# EAGLE design NFC_BusinessCard (EAGLE 9.6.2)
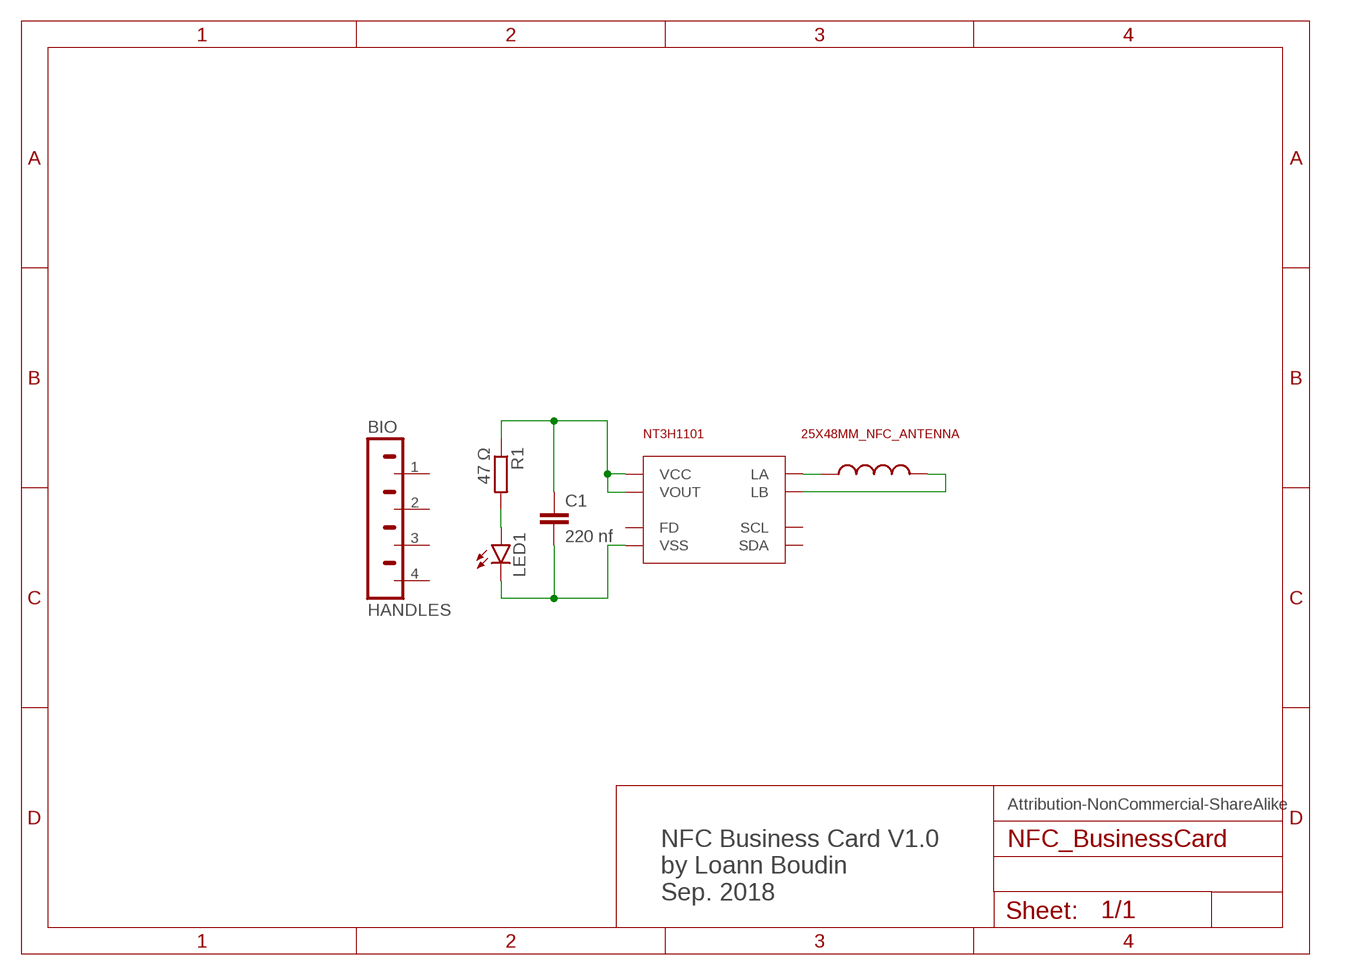
[diagram p0: schematic, sheet 1]

## Parts
ANT  25X48MM_NFC_ANTENNA  [25X48MM_NFC]
BIO  HANDLES  [MA08-1]
C1  220 nf  C-EUC0603  [C0603]
LED1  LEDSML0805  [SML0805]
NT3H1101  NT3H  [XQFN8]
R1  47 Ω  R-EU_R0603  [R0603]

## Nets
N$1: ANT.P$2 NT3H1101.LA
N$2: ANT.P$1 NT3H1101.LB
N$3: C1.1 NT3H1101.VCC NT3H1101.VOUT R1.1
N$4: LED1.A R1.2
N$6: C1.2 LED1.C NT3H1101.VSS
Unconnected: BIO.1 BIO.2 BIO.3 BIO.4 NT3H1101.FD NT3H1101.SCL NT3H1101.SDA

## Notes on the sheet
- Attribution-NonCommercial-ShareAlike
- NFC Business Card V1.0
  by Loann Boudin
  Sep. 2018

## Library data of the parts
ANT = PCB_BusinessCard:25X48MM_NFC_ANTENNA: 25x48 mm NFC loop antenna, L = 2,75 µH
BIO = handles:HANDLES
C1 = resistor:C-EU: CAPACITOR, European symbol
LED1 = led:LED: LED OSRAM: - CHIPLED LG R971, LG N971, LY N971, LG Q971, LY Q971, LO R971, LY R971 LH N974, LH R974 LS Q976, LO Q976, LY Q976 LO Q996 - Hyper CHIPLED LW Q18S LB Q993, LB Q99A, LB R99A - SideLED LS A670, LO A670, LY A670, LG A670, LP A670 LB A673, LV A673, LT A673, LW A673 LH A674 LY A675 LS A676, LA A676, LO A676, LY A676, LW A676 LS A679, LY A679, LG A679 - Hyper Micro SIDELED® LS Y876, LA Y876, LO Y876, LY Y876 LT Y87S - SmartLED LW L88C, LW L88S LB L89C, LB L89S, LG L890 LS L89K, LO L89K, LY L89K LS L896, LA L896, LO L896, LY L896 - TOPLED LS T670, LO T670, LY T670, LG T670, LP T670 LSG T670, LSP T670, LSY T670, LOP T670, LYG T670 LG T671, LOG T671, LSG T671 LB T673, LV T673, LT T673, LW T673 LH T674 LS T676, LA T676, LO T676, LY T676, LB T676, LH T676, LSB T676, LW T676 LB T67C, LV T67C, LT T67C, LS T67K, LO T67K, LY T67K, LW E67C LS E67B, LA E67B, LO E67B, LY E67B, LB E67C, LV E67C, LT E67C LW T67C LS T679, LY T679, LG T679 LS T770, LO T770, LY T770, LG T770, LP T770 LB T773, LV T773, LT T773, LW T773 LH T774 LS E675, LA E675, LY E675, LS T675 LS T776, LA T776, LO T776, LY T776, LB T776 LHGB T686 LT T68C, LB T68C - Hyper Mini TOPLED® LB M676 - Mini TOPLED Santana® LG M470 LS M47K, LO M47K, LY M47K Source: http://www.osram.convergy.de LUXEON: - LUMILED® LXK2-PW12-R00, LXK2-PW12-S00, LXK2-PW14-U00, LXK2-PW14-V00 LXK2-PM12-R00, LXK2-PM12-S00, LXK2-PM14-U00 LXK2-PE12-Q00, LXK2-PE12-R00, LXK2-PE12-S00, LXK2-PE14-T00, LXK2-PE14-U00 LXK2-PB12-K00, LXK2-PB12-L00, LXK2-PB12-M00, LXK2-PB14-N00, LXK2-PB14-P00, LXK2-PB14-Q00 LXK2-PR12-L00, LXK2-PR12-M00, LXK2-PR14-Q00, LXK2-PR14-R00 LXK2-PD12-Q00, LXK2-PD12-R00, LXK2-PD12-S00 LXK2-PH12-R00, LXK2-PH12-S00 LXK2-PL12-P00, LXK2-PL12-Q00, LXK2-PL12-R00 Source: www.luxeon.com KINGBRIGHT: KA-3528ASYC Source: www.kingbright.com
NT3H1101 = PCB_BusinessCard:NT3H
R1 = resistor:R-EU_: RESISTOR, European symbol

## Board
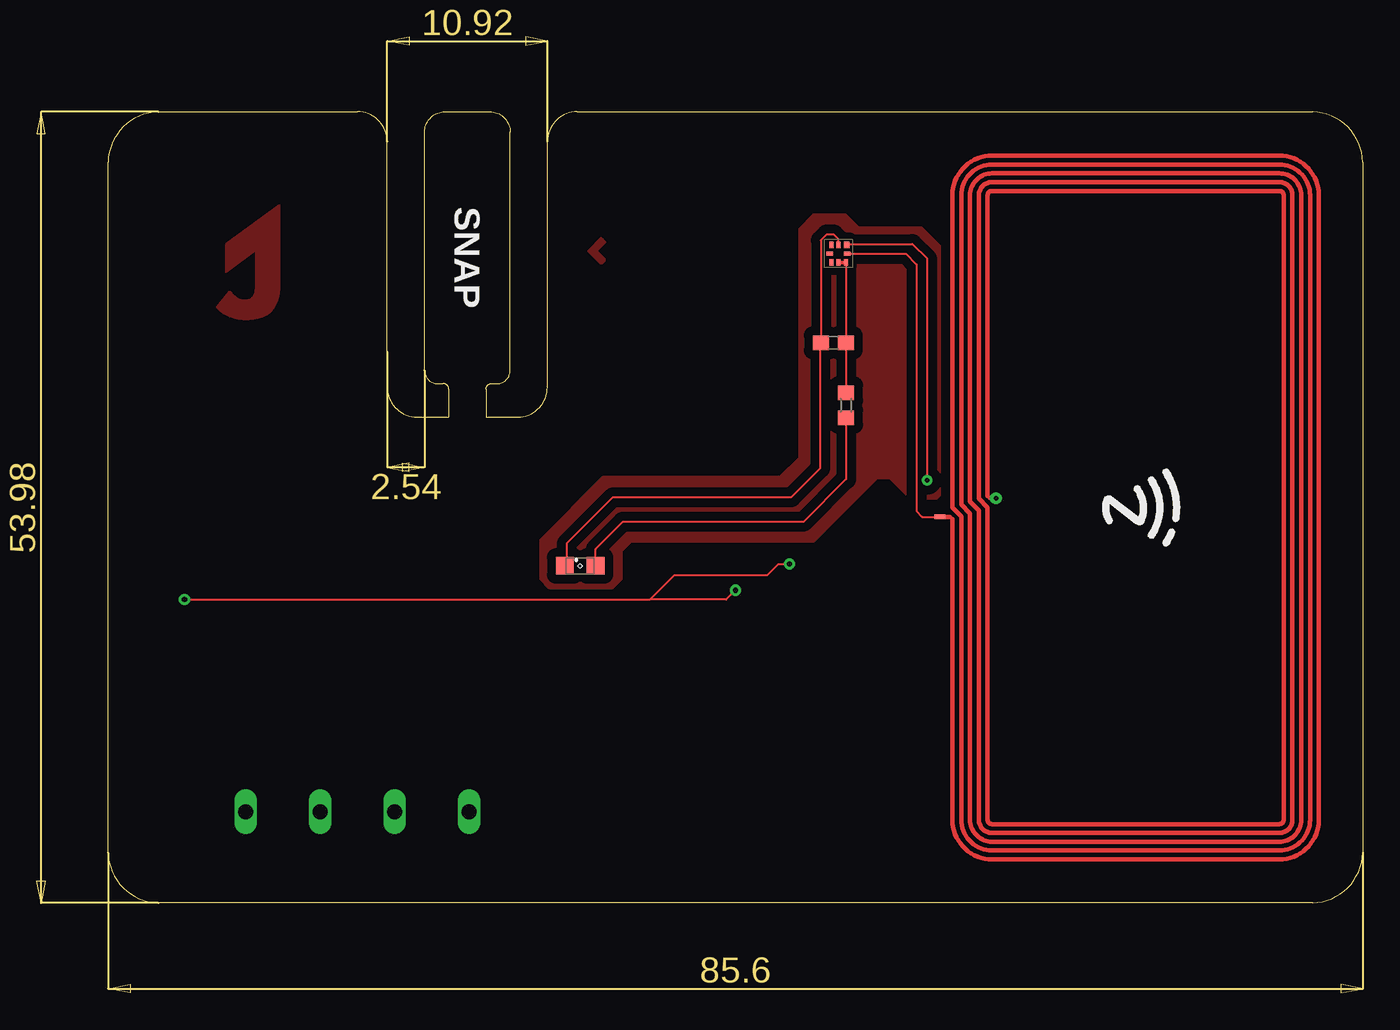
[diagram p1: board, top side]
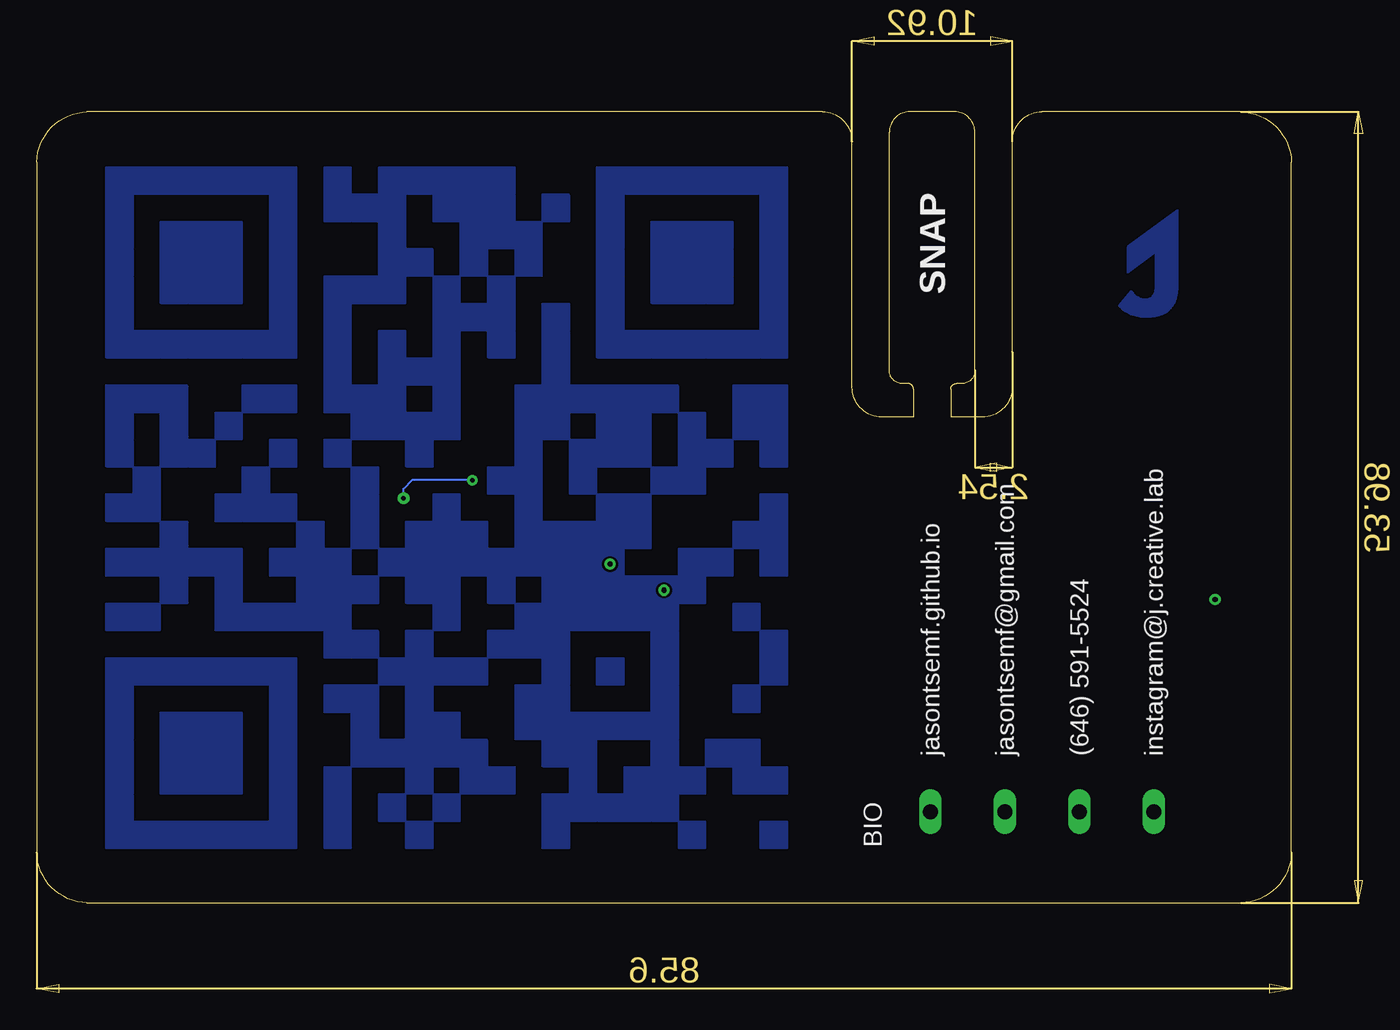
[diagram p2: board, bottom side, seen from below]

Size 85.6 x 53.98 mm. Coordinates in mm from the lower left corner, seen from the top.
Outline: 21.59,52.58 21.59,36.32 arc90 22.48,35.43 22.86,35.43 arc-90 23.24,35.05 23.24,33.15 21.08,33.15 arc-90 19.05,35.18 19.05,51.94 arc90 17.02,53.98 3.43,53.98 arc87 0,50.55 0,3.43 arc87 3.43,0 82.17,0 arc87 85.6,3.43 85.6,50.55 arc87 82.17,53.98 32,53.98 arc90 29.97,51.94 29.97,35.18 arc-90 27.94,33.15 25.78,33.15 25.78,35.05 arc-90 26.16,35.43 26.54,35.43 arc90 27.43,36.32 27.43,52.58 arc90 26.04,53.98 22.99,53.98
Outline: 21.59,52.58 arc-90 22.99,53.98
Outline: 21.59,52.58 arc-90 22.99,53.98
Copper layers (1*16): Top 0.035mm / dielectric 0.73mm / Bottom 0.035mm
Design rules "default *": minimum track width 6mil, minimum drill 0.3mm, track to track 6mil, track to pad 6mil, pad to pad 6mil, via to via 6mil, smd to smd 6mil, copper to edge 40mil, drill to drill 6mil, minimum pad ring 10mil, minimum via ring 8mil, stop-mask expansion 4mil, vias tented up to drill 0mil, thermal gap 10mil

### Footprints (pad centres in the part's own frame; a part is rotated, then mirrored left to right if it is on the bottom)
25X48MM_NFC = smd 0.3 x 0.75: P$1 -0.635,13.335 | drill 0.3: P$2 0.635,9.525
MA08-1 = drill 1.016 long: 1 -8.89,0; 2 -3.81,0; 3 1.27,0; 4 6.35,0
C0603 = smd 1.1 x 1: 1 -0.85,0; 2 0.85,0
SML0805 = smd 1.2 x 1.2: A 1.05,0; C -1.05,0
XQFN8 = smd 0.27 x 0.45: FD 0,-0.6; LB 0,0.6 | smd 0.45 x 0.37: LA -0.6,0.55 | smd 0.45 x 0.27: SCL -0.6,-0.5; SDA 0.6,-0.5; VCC 0.6,0; VOUT 0.6,0.5; VSS -0.6,0
R0603 = smd 1 x 1.1: 1 -0.85,0; 2 0.85,0

### Placement (x,y rotation side)
ANT  70.1,26.98 90 top
BIO  15.75,6.22 0 bottom
C1  49.48,38.21 180 top
LED1  32.21,23 0 top
NT3H1101  49.84,44.29 270 top
R1  50.34,33.95 270 top

### Tracks (layer width: path | path; a pad name or v marks a point on that pad's centre or on a via)
GND
  pour Top (rank 3): 7.4,40.66 7.44,40.61 7.5,40.55 7.55,40.5 7.6,40.44 7.66,40.39 7.72,40.35 7.78,40.3 7.84,40.25 7.9,40.21 7.96,40.17 8.03,40.14 8.1,40.1 8.16,40.07 8.23,40.04 8.3,40.01 8.44,39.95 8.59,39.91 8.73,39.87 8.88,39.84 9.03,39.82 9.18,39.81 9.33,39.8 9.48,39.8 9.63,39.8 9.78,39.81 9.93,39.83 10.08,39.86 10.23,39.89 10.37,39.93 10.44,39.95 10.52,39.98 10.58,40.01 10.65,40.04 10.72,40.07 10.79,40.11 10.85,40.15 10.91,40.19 10.97,40.24 11.03,40.28 11.09,40.33 11.14,40.39 11.19,40.44 11.24,40.5 11.29,40.56 11.33,40.62 11.37,40.69 11.41,40.75 11.44,40.82 11.48,40.89 11.51,40.95 11.53,41.02 11.56,41.1 11.58,41.17 11.6,41.24 11.64,41.39 11.66,41.54 11.68,41.69 11.69,41.84 11.7,41.91 11.7,42.06 11.7,47.56 11.7,47.64 8.05,44.96 8.03,44.9 8.03,43.02 10.03,44.49 10.06,44.46 10.06,41.97 10.05,41.9 10.05,41.82 10.04,41.75 10.02,41.67 10.01,41.6 9.98,41.53 9.95,41.46 9.91,41.4 9.86,41.34 9.81,41.29 9.75,41.24 9.68,41.2 9.62,41.17 9.54,41.15 9.47,41.14 9.39,41.13 9.32,41.13 9.24,41.13 9.17,41.14 9.1,41.15 9.02,41.17 8.95,41.2 8.88,41.23 8.82,41.26 8.75,41.3 8.69,41.34 8.63,41.39 8.57,41.44 8.52,41.49 8.47,41.54 8.42,41.6 8.32,41.72 8.27,41.7
  pour Bottom (rank 3): 80.87,50.2 79.03,50.2 79.01,50.15 79.01,48.38 79.05,48.34 80.82,48.34 80.87,48.36
  pour Bottom (rank 3): 79.01,50.2 77.17,50.2 77.15,50.15 77.15,48.38 77.19,48.34 78.96,48.34 79.01,48.36
  pour Bottom (rank 3): 77.15,50.2 75.31,50.2 75.29,50.15 75.29,48.38 75.33,48.34 77.1,48.34 77.15,48.36
  pour Bottom (rank 3): 75.29,50.2 73.45,50.2 73.43,50.15 73.43,48.38 73.47,48.34 75.24,48.34 75.29,48.36
  pour Bottom (rank 3): 73.43,50.2 71.59,50.2 71.58,50.15 71.58,48.38 71.61,48.34 73.38,48.34 73.43,48.36
  pour Bottom (rank 3): 71.58,50.2 69.73,50.2 69.72,50.15 69.72,48.38 69.75,48.34 71.52,48.34 71.58,48.36
  pour Bottom (rank 3): 69.72,50.2 67.87,50.2 67.86,50.15 67.86,48.38 67.89,48.34 69.66,48.34 69.72,48.36
  pour Bottom (rank 3): 66,50.2 64.15,50.2 64.14,50.15 64.14,48.38 64.17,48.34 65.94,48.34 66,48.36
  pour Bottom (rank 3): 62.28,50.2 60.43,50.2 60.42,50.15 60.42,48.38 60.45,48.34 62.22,48.34 62.28,48.36
  pour Bottom (rank 3): 60.42,50.2 58.57,50.2 58.56,50.15 58.56,48.38 58.59,48.34 60.36,48.34 60.42,48.36
  pour Bottom (rank 3): 58.56,50.2 56.71,50.2 56.7,50.15 56.7,48.38 56.73,48.34 58.5,48.34 58.56,48.36
  pour Bottom (rank 3): 56.7,50.2 54.85,50.2 54.84,50.15 54.84,48.38 54.87,48.34 56.64,48.34 56.7,48.36
  pour Bottom (rank 3): 54.84,50.2 52.99,50.2 52.98,50.15 52.98,48.38 53.01,48.34 54.78,48.34 54.84,48.36
  pour Bottom (rank 3): 47.4,50.2 45.55,50.2 45.54,50.15 45.54,48.38 45.57,48.34 47.34,48.34 47.4,48.36
  pour Bottom (rank 3): 45.54,50.2 43.7,50.2 43.68,50.15 43.68,48.38 43.71,48.34 45.48,48.34 45.54,48.36
  pour Bottom (rank 3): 43.68,50.2 41.84,50.2 41.82,50.15 41.82,48.38 41.85,48.34 43.62,48.34 43.68,48.36
  pour Bottom (rank 3): 41.82,50.2 39.98,50.2 39.96,50.15 39.96,48.38 39.99,48.34 41.76,48.34 41.82,48.36
  pour Bottom (rank 3): 39.96,50.2 38.12,50.2 38.1,50.15 38.1,48.38 38.13,48.34 39.9,48.34 39.96,48.36
  pour Bottom (rank 3): 38.1,50.2 36.26,50.2 36.24,50.15 36.24,48.38 36.27,48.34 38.04,48.34 38.1,48.36
  pour Bottom (rank 3): 36.24,50.2 34.4,50.2 34.38,50.15 34.38,48.38 34.41,48.34 36.18,48.34 36.24,48.36
  pour Bottom (rank 3): 80.87,48.34 79.03,48.34 79.01,48.29 79.01,46.52 79.05,46.48 80.82,46.48 80.87,46.5
  pour Bottom (rank 3): 69.72,48.34 67.87,48.34 67.86,48.29 67.86,46.52 67.89,46.48 69.66,46.48 69.72,46.5
  pour Bottom (rank 3): 66,48.34 64.15,48.34 64.14,48.29 64.14,46.52 64.17,46.48 65.94,46.48 66,46.5
  pour Bottom (rank 3): 64.14,48.34 62.29,48.34 62.28,48.29 62.28,46.52 62.31,46.48 64.08,46.48 64.14,46.5
  pour Bottom (rank 3): 62.28,48.34 60.43,48.34 60.42,48.29 60.42,46.52 60.45,46.48 62.22,46.48 62.28,46.5
  pour Bottom (rank 3): 58.56,48.34 56.71,48.34 56.7,48.29 56.7,46.52 56.73,46.48 58.5,46.48 58.56,46.5
  pour Bottom (rank 3): 56.7,48.34 54.85,48.34 54.84,48.29 54.84,46.52 54.87,46.48 56.64,46.48 56.7,46.5
  pour Bottom (rank 3): 54.84,48.34 52.99,48.34 52.98,48.29 52.98,46.52 53.01,46.48 54.78,46.48 54.84,46.5
  pour Bottom (rank 3): 51.12,48.34 49.27,48.34 49.26,48.29 49.26,46.52 49.29,46.48 51.06,46.48 51.12,46.5
  pour Bottom (rank 3): 47.4,48.34 45.56,48.34 45.54,48.29 45.54,46.52 45.57,46.48 47.34,46.48 47.4,46.5
  pour Bottom (rank 3): 36.24,48.34 34.4,48.34 34.38,48.29 34.38,46.52 34.41,46.48 36.18,46.48 36.24,46.5
  pour Bottom (rank 3): 80.87,46.48 79.03,46.48 79.01,46.43 79.01,44.66 79.05,44.62 80.82,44.62 80.87,44.64
  pour Bottom (rank 3): 77.15,46.48 75.31,46.48 75.29,46.43 75.29,44.66 75.33,44.62 77.1,44.62 77.15,44.64
  pour Bottom (rank 3): 75.29,46.48 73.45,46.48 73.43,46.43 73.43,44.66 73.47,44.62 75.24,44.62 75.29,44.64
  pour Bottom (rank 3): 73.43,46.48 71.59,46.48 71.58,46.43 71.58,44.66 71.61,44.62 73.38,44.62 73.43,44.64
  pour Bottom (rank 3): 69.72,46.48 67.87,46.48 67.86,46.43 67.86,44.66 67.89,44.62 69.66,44.62 69.72,44.64
  pour Bottom (rank 3): 62.28,46.48 60.43,46.48 60.42,46.43 60.42,44.66 60.45,44.62 62.22,44.62 62.28,44.64
  pour Bottom (rank 3): 56.7,46.48 54.85,46.48 54.84,46.43 54.84,44.66 54.87,44.62 56.64,44.62 56.7,44.64
  pour Bottom (rank 3): 54.84,46.48 52.99,46.48 52.98,46.43 52.98,44.66 53.01,44.62 54.78,44.62 54.84,44.64
  pour Bottom (rank 3): 52.98,46.48 51.13,46.48 51.12,46.43 51.12,44.66 51.15,44.62 52.92,44.62 52.98,44.64
  pour Bottom (rank 3): 47.4,46.48 45.55,46.48 45.54,46.43 45.54,44.66 45.57,44.62 47.34,44.62 47.4,44.64
  pour Bottom (rank 3): 43.68,46.48 41.84,46.48 41.82,46.43 41.82,44.66 41.85,44.62 43.62,44.62 43.68,44.64
  pour Bottom (rank 3): 41.82,46.48 39.98,46.48 39.96,46.43 39.96,44.66 39.99,44.62 41.76,44.62 41.82,44.64
  pour Bottom (rank 3): 39.96,46.48 38.12,46.48 38.1,46.43 38.1,44.66 38.13,44.62 39.9,44.62 39.96,44.64
  pour Bottom (rank 3): 36.24,46.48 34.4,46.48 34.38,46.43 34.38,44.66 34.41,44.62 36.18,44.62 36.24,44.64
  pour Bottom (rank 3): 80.87,44.62 79.03,44.62 79.01,44.57 79.01,42.8 79.05,42.76 80.82,42.76 80.87,42.78
  pour Bottom (rank 3): 77.15,44.62 75.31,44.62 75.29,44.57 75.29,42.8 75.33,42.76 77.1,42.76 77.15,42.78
  pour Bottom (rank 3): 75.29,44.62 73.45,44.62 73.43,44.57 73.43,42.8 73.47,42.76 75.24,42.76 75.29,42.78
  pour Bottom (rank 3): 73.43,44.62 71.59,44.62 71.58,44.57 71.58,42.8 71.61,42.76 73.38,42.76 73.43,42.78
  pour Bottom (rank 3): 69.72,44.62 67.87,44.62 67.86,44.57 67.86,42.8 67.89,42.76 69.66,42.76 69.72,42.78
  pour Bottom (rank 3): 62.28,44.62 60.43,44.62 60.42,44.57 60.42,42.8 60.45,42.76 62.22,42.76 62.28,42.78
  pour Bottom (rank 3): 60.42,44.62 58.57,44.62 58.56,44.57 58.56,42.8 58.59,42.76 60.36,42.76 60.42,42.78
  pour Bottom (rank 3): 56.7,44.62 54.85,44.62 54.84,44.57 54.84,42.8 54.87,42.76 56.64,42.76 56.7,42.78
  pour Bottom (rank 3): 52.98,44.62 51.13,44.62 51.12,44.57 51.12,42.8 51.15,42.76 52.92,42.76 52.98,42.78
  pour Bottom (rank 3): 47.4,44.62 45.55,44.62 45.54,44.57 45.54,42.8 45.57,42.76 47.34,42.76 47.4,42.78
  pour Bottom (rank 3): 43.68,44.62 41.84,44.62 41.82,44.57 41.82,42.8 41.85,42.76 43.62,42.76 43.68,42.78
  pour Bottom (rank 3): 41.82,44.62 39.98,44.62 39.96,44.57 39.96,42.8 39.99,42.76 41.76,42.76 41.82,42.78
  pour Bottom (rank 3): 39.96,44.62 38.12,44.62 38.1,44.57 38.1,42.8 38.13,42.76 39.9,42.76 39.96,42.78
  pour Bottom (rank 3): 36.24,44.62 34.4,44.62 34.38,44.57 34.38,42.8 34.41,42.76 36.18,42.76 36.24,42.78
  pour Bottom (rank 3): 80.87,42.76 79.03,42.76 79.01,42.71 79.01,40.94 79.05,40.9 80.82,40.9 80.87,40.92
  pour Bottom (rank 3): 77.15,42.76 75.31,42.76 75.29,42.71 75.29,40.94 75.33,40.9 77.1,40.9 77.15,40.92
  pour Bottom (rank 3): 75.29,42.76 73.45,42.76 73.43,42.71 73.43,40.94 73.47,40.9 75.24,40.9 75.29,40.92
  pour Bottom (rank 3): 73.43,42.76 71.59,42.76 71.58,42.71 71.58,40.94 71.61,40.9 73.38,40.9 73.43,40.92
  pour Bottom (rank 3): 69.72,42.76 67.87,42.76 67.86,42.71 67.86,40.94 67.89,40.9 69.66,40.9 69.72,40.92
  pour Bottom (rank 3): 66,42.76 64.15,42.76 64.14,42.71 64.14,40.94 64.17,40.9 65.94,40.9 66,40.92
  pour Bottom (rank 3): 64.14,42.76 62.29,42.76 62.28,42.71 62.28,40.94 62.31,40.9 64.08,40.9 64.14,40.92
  pour Bottom (rank 3): 62.28,42.76 60.43,42.76 60.42,42.71 60.42,40.94 60.45,40.9 62.22,40.9 62.28,40.92
  pour Bottom (rank 3): 58.56,42.76 56.71,42.76 56.7,42.71 56.7,40.94 56.73,40.9 58.5,40.9 58.56,40.92
  pour Bottom (rank 3): 54.84,42.76 52.99,42.76 52.98,42.71 52.98,40.94 53.01,40.9 54.78,40.9 54.84,40.92
  pour Bottom (rank 3): 47.4,42.76 45.56,42.76 45.54,42.71 45.54,40.94 45.57,40.9 47.34,40.9 47.4,40.92
  pour Bottom (rank 3): 43.68,42.76 41.84,42.76 41.82,42.71 41.82,40.94 41.85,40.9 43.62,40.9 43.68,40.92
  pour Bottom (rank 3): 41.82,42.76 39.98,42.76 39.96,42.71 39.96,40.94 39.99,40.9 41.76,40.9 41.82,40.92
  pour Bottom (rank 3): 39.96,42.76 38.12,42.76 38.1,42.71 38.1,40.94 38.13,40.9 39.9,40.9 39.96,40.92
  pour Bottom (rank 3): 36.24,42.76 34.4,42.76 34.38,42.71 34.38,40.94 34.41,40.9 36.18,40.9 36.24,40.92
  pour Bottom (rank 3): 80.87,40.9 79.03,40.9 79.01,40.85 79.01,39.08 79.05,39.04 80.82,39.04 80.87,39.06
  pour Bottom (rank 3): 69.72,40.9 67.87,40.9 67.86,40.85 67.86,39.08 67.89,39.04 69.66,39.04 69.72,39.06
  pour Bottom (rank 3): 66,40.9 64.15,40.9 64.14,40.85 64.14,39.08 64.17,39.04 65.94,39.04 66,39.06
  pour Bottom (rank 3): 58.56,40.9 56.71,40.9 56.7,40.85 56.7,39.08 56.73,39.04 58.5,39.04 58.56,39.06
  pour Bottom (rank 3): 56.7,40.9 54.85,40.9 54.84,40.85 54.84,39.08 54.87,39.04 56.64,39.04 56.7,39.06
  pour Bottom (rank 3): 54.84,40.9 52.99,40.9 52.98,40.85 52.98,39.08 53.01,39.04 54.78,39.04 54.84,39.06
  pour Bottom (rank 3): 51.12,40.9 49.27,40.9 49.26,40.85 49.26,39.08 49.29,39.04 51.06,39.04 51.12,39.06
  pour Bottom (rank 3): 47.4,40.9 45.55,40.9 45.54,40.85 45.54,39.08 45.57,39.04 47.34,39.04 47.4,39.06
  pour Bottom (rank 3): 36.24,40.9 34.4,40.9 34.38,40.85 34.38,39.08 34.41,39.04 36.18,39.04 36.24,39.06
  pour Bottom (rank 3): 80.87,39.04 79.03,39.04 79.01,38.99 79.01,37.22 79.05,37.18 80.82,37.18 80.87,37.2
  pour Bottom (rank 3): 79.01,39.04 77.17,39.04 77.15,38.99 77.15,37.22 77.19,37.18 78.96,37.18 79.01,37.2
  pour Bottom (rank 3): 77.15,39.04 75.31,39.04 75.29,38.99 75.29,37.22 75.33,37.18 77.1,37.18 77.15,37.2
  pour Bottom (rank 3): 75.29,39.04 73.45,39.04 73.43,38.99 73.43,37.22 73.47,37.18 75.24,37.18 75.29,37.2
  pour Bottom (rank 3): 73.43,39.04 71.59,39.04 71.58,38.99 71.58,37.22 71.61,37.18 73.38,37.18 73.43,37.2
  pour Bottom (rank 3): 71.58,39.04 69.73,39.04 69.72,38.99 69.72,37.22 69.75,37.18 71.52,37.18 71.58,37.2
  pour Bottom (rank 3): 69.72,39.04 67.87,39.04 67.86,38.99 67.86,37.22 67.89,37.18 69.66,37.18 69.72,37.2
  pour Bottom (rank 3): 66,39.04 64.15,39.04 64.14,38.99 64.14,37.22 64.17,37.18 65.94,37.18 66,37.2
  pour Bottom (rank 3): 62.28,39.04 60.43,39.04 60.42,38.99 60.42,37.22 60.45,37.18 62.22,37.18 62.28,37.2
  pour Bottom (rank 3): 58.56,39.04 56.71,39.04 56.7,38.99 56.7,37.22 56.73,37.18 58.5,37.18 58.56,37.2
  pour Bottom (rank 3): 54.84,39.04 52.99,39.04 52.98,38.99 52.98,37.22 53.01,37.18 54.78,37.18 54.84,37.2
  pour Bottom (rank 3): 51.12,39.04 49.27,39.04 49.26,38.99 49.26,37.22 49.29,37.18 51.06,37.18 51.12,37.2
  pour Bottom (rank 3): 47.4,39.04 45.56,39.04 45.54,38.99 45.54,37.22 45.57,37.18 47.34,37.18 47.4,37.2
  pour Bottom (rank 3): 45.54,39.04 43.7,39.04 43.68,38.99 43.68,37.22 43.71,37.18 45.48,37.18 45.54,37.2
  pour Bottom (rank 3): 43.68,39.04 41.84,39.04 41.82,38.99 41.82,37.22 41.85,37.18 43.62,37.18 43.68,37.2
  pour Bottom (rank 3): 41.82,39.04 39.98,39.04 39.96,38.99 39.96,37.22 39.99,37.18 41.76,37.18 41.82,37.2
  pour Bottom (rank 3): 39.96,39.04 38.12,39.04 38.1,38.99 38.1,37.22 38.13,37.18 39.9,37.18 39.96,37.2
  pour Bottom (rank 3): 38.1,39.04 36.26,39.04 36.24,38.99 36.24,37.22 36.27,37.18 38.04,37.18 38.1,37.2
  pour Bottom (rank 3): 36.24,39.04 34.4,39.04 34.38,38.99 34.38,37.22 34.41,37.18 36.18,37.18 36.24,37.2
  pour Bottom (rank 3): 66,37.18 64.15,37.18 64.14,37.13 64.14,35.36 64.17,35.32 65.94,35.32 66,35.34
  pour Bottom (rank 3): 62.28,37.18 60.43,37.18 60.42,37.13 60.42,35.36 60.45,35.32 62.22,35.32 62.28,35.34
  pour Bottom (rank 3): 60.42,37.18 58.57,37.18 58.56,37.13 58.56,35.36 58.59,35.32 60.36,35.32 60.42,35.34
  pour Bottom (rank 3): 58.56,37.18 56.71,37.18 56.7,37.13 56.7,35.36 56.73,35.32 58.5,35.32 58.56,35.34
  pour Bottom (rank 3): 51.12,37.18 49.27,37.18 49.26,37.13 49.26,35.36 49.29,35.32 51.06,35.32 51.12,35.34
  pour Bottom (rank 3): 80.87,35.32 79.03,35.32 79.01,35.27 79.01,33.5 79.05,33.46 80.82,33.46 80.87,33.48
  pour Bottom (rank 3): 79.01,35.32 77.17,35.32 77.15,35.27 77.15,33.5 77.19,33.46 78.96,33.46 79.01,33.48
  pour Bottom (rank 3): 77.15,35.32 75.31,35.32 75.29,35.27 75.29,33.5 75.33,33.46 77.1,33.46 77.15,33.48
  pour Bottom (rank 3): 71.58,35.32 69.73,35.32 69.72,35.27 69.72,33.5 69.75,33.46 71.52,33.46 71.58,33.48
  pour Bottom (rank 3): 69.72,35.32 67.87,35.32 67.86,35.27 67.86,33.5 67.89,33.46 69.66,33.46 69.72,33.48
  pour Bottom (rank 3): 66,35.32 64.15,35.32 64.14,35.27 64.14,33.5 64.17,33.46 65.94,33.46 66,33.48
  pour Bottom (rank 3): 64.14,35.32 62.29,35.32 62.28,35.27 62.28,33.5 62.31,33.46 64.08,33.46 64.14,33.48
  pour Bottom (rank 3): 62.28,35.32 60.43,35.32 60.42,35.27 60.42,33.5 60.45,33.46 62.22,33.46 62.28,33.48
  pour Bottom (rank 3): 58.56,35.32 56.71,35.32 56.7,35.27 56.7,33.5 56.73,33.46 58.5,33.46 58.56,33.48
  pour Bottom (rank 3): 52.98,35.32 51.13,35.32 51.12,35.27 51.12,33.5 51.15,33.46 52.92,33.46 52.98,33.48
  pour Bottom (rank 3): 51.12,35.32 49.27,35.32 49.26,35.27 49.26,33.5 49.29,33.46 51.06,33.46 51.12,33.48
  pour Bottom (rank 3): 49.26,35.32 47.41,35.32 47.4,35.27 47.4,33.5 47.43,33.46 49.2,33.46 49.26,33.48
  pour Bottom (rank 3): 47.4,35.32 45.56,35.32 45.54,35.27 45.54,33.5 45.57,33.46 47.34,33.46 47.4,33.48
  pour Bottom (rank 3): 45.54,35.32 43.7,35.32 43.68,35.27 43.68,33.5 43.71,33.46 45.48,33.46 45.54,33.48
  pour Bottom (rank 3): 43.68,35.32 41.84,35.32 41.82,35.27 41.82,33.5 41.85,33.46 43.62,33.46 43.68,33.48
  pour Bottom (rank 3): 38.1,35.32 36.26,35.32 36.24,35.27 36.24,33.5 36.27,33.46 38.04,33.46 38.1,33.48
  pour Bottom (rank 3): 36.24,35.32 34.4,35.32 34.38,35.27 34.38,33.5 34.41,33.46 36.18,33.46 36.24,33.48
  pour Bottom (rank 3): 80.87,33.46 79.03,33.46 79.01,33.41 79.01,31.64 79.05,31.6 80.82,31.6 80.87,31.62
  pour Bottom (rank 3): 77.15,33.46 75.31,33.46 75.29,33.41 75.29,31.64 75.33,31.6 77.1,31.6 77.15,31.62
  pour Bottom (rank 3): 73.43,33.46 71.59,33.46 71.58,33.41 71.58,31.64 71.61,31.6 73.38,31.6 73.43,31.62
  pour Bottom (rank 3): 64.14,33.46 62.29,33.46 62.28,33.41 62.28,31.64 62.31,31.6 64.08,31.6 64.14,31.62
  pour Bottom (rank 3): 62.28,33.46 60.43,33.46 60.42,33.41 60.42,31.64 60.45,31.6 62.22,31.6 62.28,31.62
  pour Bottom (rank 3): 60.42,33.46 58.57,33.46 58.56,33.41 58.56,31.64 58.59,31.6 60.36,31.6 60.42,31.62
  pour Bottom (rank 3): 58.56,33.46 56.71,33.46 56.7,33.41 56.7,31.64 56.73,31.6 58.5,31.6 58.56,31.62
  pour Bottom (rank 3): 52.98,33.46 51.13,33.46 51.12,33.41 51.12,31.64 51.15,31.6 52.92,31.6 52.98,31.62
  pour Bottom (rank 3): 51.12,33.46 49.27,33.46 49.26,33.41 49.26,31.64 49.29,31.6 51.06,31.6 51.12,31.62
  pour Bottom (rank 3): 47.4,33.46 45.55,33.46 45.54,33.41 45.54,31.64 45.57,31.6 47.34,31.6 47.4,31.62
  pour Bottom (rank 3): 45.54,33.46 43.7,33.46 43.68,33.41 43.68,31.64 43.71,31.6 45.48,31.6 45.54,31.62
  pour Bottom (rank 3): 41.82,33.46 39.98,33.46 39.96,33.41 39.96,31.64 39.99,31.6 41.76,31.6 41.82,31.62
  pour Bottom (rank 3): 38.1,33.46 36.26,33.46 36.24,33.41 36.24,31.64 36.27,31.6 38.04,31.6 38.1,31.62
  pour Bottom (rank 3): 36.24,33.46 34.4,33.46 34.38,33.41 34.38,31.64 34.41,31.6 36.18,31.6 36.24,31.62
  pour Bottom (rank 3): 80.87,31.6 79.03,31.6 79.01,31.55 79.01,29.78 79.05,29.74 80.82,29.74 80.87,29.76
  pour Bottom (rank 3): 77.15,31.6 75.31,31.6 75.29,31.55 75.29,29.78 75.33,29.74 77.1,29.74 77.15,29.76
  pour Bottom (rank 3): 75.29,31.6 73.45,31.6 73.43,31.55 73.43,29.78 73.47,29.74 75.24,29.74 75.29,29.76
  pour Bottom (rank 3): 69.72,31.6 67.87,31.6 67.86,31.55 67.86,29.78 67.89,29.74 69.66,29.74 69.72,29.76
  pour Bottom (rank 3): 66,31.6 64.15,31.6 64.14,31.55 64.14,29.78 64.17,29.74 65.94,29.74 66,29.76
  pour Bottom (rank 3): 60.42,31.6 58.57,31.6 58.56,31.55 58.56,29.78 58.59,29.74 60.36,29.74 60.42,29.76
  pour Bottom (rank 3): 52.98,31.6 51.13,31.6 51.12,31.55 51.12,29.78 51.15,29.74 52.92,29.74 52.98,29.76
  pour Bottom (rank 3): 49.26,31.6 47.41,31.6 47.4,31.55 47.4,29.78 47.43,29.74 49.2,29.74 49.26,29.76
  pour Bottom (rank 3): 47.4,31.6 45.56,31.6 45.54,31.55 45.54,29.78 45.57,29.74 47.34,29.74 47.4,29.76
  pour Bottom (rank 3): 45.54,31.6 43.7,31.6 43.68,31.55 43.68,29.78 43.71,29.74 45.48,29.74 45.54,29.76
  pour Bottom (rank 3): 41.82,31.6 39.98,31.6 39.96,31.55 39.96,29.78 39.99,29.74 41.76,29.74 41.82,29.76
  pour Bottom (rank 3): 39.96,31.6 38.12,31.6 38.1,31.55 38.1,29.78 38.13,29.74 39.9,29.74 39.96,29.76
  pour Bottom (rank 3): 36.24,31.6 34.4,31.6 34.38,31.55 34.38,29.78 34.41,29.74 36.18,29.74 36.24,29.76
  pour Bottom (rank 3): 79.01,29.74 77.17,29.74 77.15,29.69 77.15,27.92 77.19,27.88 78.96,27.88 79.01,27.9
  pour Bottom (rank 3): 71.58,29.74 69.73,29.74 69.72,29.69 69.72,27.92 69.75,27.88 71.52,27.88 71.58,27.9
  pour Bottom (rank 3): 64.14,29.74 62.29,29.74 62.28,29.69 62.28,27.92 62.31,27.88 64.08,27.88 64.14,27.9
  pour Bottom (rank 3): 54.84,29.74 52.99,29.74 52.98,29.69 52.98,27.92 53.01,27.88 54.78,27.88 54.84,27.9
  pour Bottom (rank 3): 52.98,29.74 51.13,29.74 51.12,29.69 51.12,27.92 51.15,27.88 52.92,27.88 52.98,27.9
  pour Bottom (rank 3): 49.26,29.74 47.41,29.74 47.4,29.69 47.4,27.92 47.43,27.88 49.2,27.88 49.26,27.9
  pour Bottom (rank 3): 43.68,29.74 41.84,29.74 41.82,29.69 41.82,27.92 41.85,27.88 43.62,27.88 43.68,27.9
  pour Bottom (rank 3): 41.82,29.74 39.98,29.74 39.96,29.69 39.96,27.92 39.99,27.88 41.76,27.88 41.82,27.9
  pour Bottom (rank 3): 80.87,27.88 79.03,27.88 79.01,27.83 79.01,26.06 79.05,26.02 80.82,26.02 80.87,26.04
  pour Bottom (rank 3): 79.01,27.88 77.17,27.88 77.15,27.83 77.15,26.06 77.19,26.02 78.96,26.02 79.01,26.04
  pour Bottom (rank 3): 73.43,27.88 71.59,27.88 71.58,27.83 71.58,26.06 71.61,26.02 73.38,26.02 73.43,26.04
  pour Bottom (rank 3): 71.58,27.88 69.73,27.88 69.72,27.83 69.72,26.06 69.75,26.02 71.52,26.02 71.58,26.04
  pour Bottom (rank 3): 69.72,27.88 67.87,27.88 67.86,27.83 67.86,26.06 67.89,26.02 69.66,26.02 69.72,26.04
  pour Bottom (rank 3): 64.14,27.88 62.29,27.88 62.28,27.83 62.28,26.06 62.31,26.02 64.08,26.02 64.14,26.04
  pour Bottom (rank 3): 58.56,27.88 56.71,27.88 56.7,27.83 56.7,26.06 56.73,26.02 58.5,26.02 58.56,26.04
  pour Bottom (rank 3): 52.98,27.88 51.13,27.88 51.12,27.83 51.12,26.06 51.15,26.02 52.92,26.02 52.98,26.04
  pour Bottom (rank 3): 47.4,27.88 45.56,27.88 45.54,27.83 45.54,26.06 45.57,26.02 47.34,26.02 47.4,26.04
  pour Bottom (rank 3): 45.54,27.88 43.7,27.88 43.68,27.83 43.68,26.06 43.71,26.02 45.48,26.02 45.54,26.04
  pour Bottom (rank 3): 36.24,27.88 34.4,27.88 34.38,27.83 34.38,26.06 34.41,26.02 36.18,26.02 36.24,26.04
  pour Bottom (rank 3): 77.15,26.02 75.31,26.02 75.29,25.97 75.29,24.2 75.33,24.16 77.1,24.16 77.15,24.18
  pour Bottom (rank 3): 67.86,26.02 66.01,26.02 66,25.97 66,24.2 66.03,24.16 67.8,24.16 67.86,24.18
  pour Bottom (rank 3): 64.14,26.02 62.29,26.02 62.28,25.97 62.28,24.2 62.31,24.16 64.08,24.16 64.14,24.18
  pour Bottom (rank 3): 60.42,26.02 58.57,26.02 58.56,25.97 58.56,24.2 58.59,24.16 60.36,24.16 60.42,24.18
  pour Bottom (rank 3): 58.56,26.02 56.71,26.02 56.7,25.97 56.7,24.2 56.73,24.16 58.5,24.16 58.56,24.18
  pour Bottom (rank 3): 56.7,26.02 54.85,26.02 54.84,25.97 54.84,24.2 54.87,24.16 56.64,24.16 56.7,24.18
  pour Bottom (rank 3): 52.98,26.02 51.13,26.02 51.12,25.97 51.12,24.2 51.15,24.16 52.92,24.16 52.98,24.18
  pour Bottom (rank 3): 51.12,26.02 49.27,26.02 49.26,25.97 49.26,24.2 49.29,24.16 51.06,24.16 51.12,24.18
  pour Bottom (rank 3): 49.26,26.02 47.41,26.02 47.4,25.97 47.4,24.2 47.43,24.16 49.2,24.16 49.26,24.18
  pour Bottom (rank 3): 47.4,26.02 45.55,26.02 45.54,25.97 45.54,24.2 45.57,24.16 47.34,24.16 47.4,24.18
  pour Bottom (rank 3): 45.54,26.02 43.7,26.02 43.68,25.97 43.68,24.2 43.71,24.16 45.48,24.16 45.54,24.18
  pour Bottom (rank 3): 38.1,26.02 36.26,26.02 36.24,25.97 36.24,24.2 36.27,24.16 38.04,24.16 38.1,24.18
  pour Bottom (rank 3): 36.24,26.02 34.4,26.02 34.38,25.97 34.38,24.2 34.41,24.16 36.18,24.16 36.24,24.18
  pour Bottom (rank 3): 80.87,24.16 79.03,24.16 79.01,24.11 79.01,22.34 79.05,22.3 80.82,22.3 80.87,22.32
  pour Bottom (rank 3): 79.01,24.16 77.17,24.16 77.15,24.11 77.15,22.34 77.19,22.3 78.96,22.3 79.01,22.32
  pour Bottom (rank 3): 77.15,24.16 75.31,24.16 75.29,24.11 75.29,22.34 75.33,22.3 77.1,22.3 77.15,22.32
  pour Bottom (rank 3): 75.29,24.16 73.45,24.16 73.43,24.11 73.43,22.34 73.47,22.3 75.24,22.3 75.29,22.32
  pour Bottom (rank 3): 73.43,24.16 71.59,24.16 71.58,24.11 71.58,22.34 71.61,22.3 73.38,22.3 73.43,22.32
  pour Bottom (rank 3): 69.72,24.16 67.87,24.16 67.86,24.11 67.86,22.34 67.89,22.3 69.66,22.3 69.72,22.32
  pour Bottom (rank 3): 67.86,24.16 66.01,24.16 66,24.11 66,22.34 66.03,22.3 67.8,22.3 67.86,22.32
  pour Bottom (rank 3): 66,24.16 64.15,24.16 64.14,24.11 64.14,22.34 64.17,22.3 65.94,22.3 66,22.32
  pour Bottom (rank 3): 62.28,24.16 60.43,24.16 60.42,24.11 60.42,22.34 60.45,22.3 62.22,22.3 62.28,22.32
  pour Bottom (rank 3): 60.42,24.16 58.57,24.16 58.56,24.11 58.56,22.34 58.59,22.3 60.36,22.3 60.42,22.32
  pour Bottom (rank 3): 58.56,24.16 56.71,24.16 56.7,24.11 56.7,22.34 56.73,22.3 58.5,22.3 58.56,22.32
  pour Bottom (rank 3): 56.7,24.16 54.85,24.16 54.84,24.11 54.84,22.34 54.87,22.3 56.64,22.3 56.7,22.32
  pour Bottom (rank 3): 54.84,24.16 52.99,24.16 52.98,24.11 52.98,22.34 53.01,22.3 54.78,22.3 54.84,22.32
  pour Bottom (rank 3): 52.98,24.16 51.13,24.16 51.12,24.11 51.12,22.34 51.15,22.3 52.92,22.3 52.98,22.32
  pour Bottom (rank 3): 51.12,24.16 49.27,24.16 49.26,24.11 49.26,22.34 49.29,22.3 51.06,22.3 51.12,22.32
  pour Bottom (rank 3): 49.26,24.16 47.41,24.16 47.4,24.11 47.4,22.34 47.43,22.3 49.2,22.3 49.26,22.32
  pour Bottom (rank 3): 47.4,24.16 45.55,24.16 45.54,24.11 45.54,22.34 45.57,22.3 47.34,22.3 47.4,22.32
  pour Bottom (rank 3): 41.82,24.16 39.98,24.16 39.96,24.11 39.96,22.34 39.99,22.3 41.76,22.3 41.82,22.32
  pour Bottom (rank 3): 39.96,24.16 38.12,24.16 38.1,24.11 38.1,22.34 38.13,22.3 39.9,22.3 39.96,22.32
  pour Bottom (rank 3): 36.24,24.16 34.4,24.16 34.38,24.11 34.38,22.34 34.41,22.3 36.18,22.3 36.24,22.32
  pour Bottom (rank 3): 77.15,22.3 75.31,22.3 75.29,22.25 75.29,20.48 75.33,20.44 77.1,20.44 77.15,20.46
  pour Bottom (rank 3): 73.43,22.3 71.59,22.3 71.58,22.25 71.58,20.48 71.61,20.44 73.38,20.44 73.43,20.46
  pour Bottom (rank 3): 67.86,22.3 66.01,22.3 66,22.25 66,20.48 66.03,20.44 67.8,20.44 67.86,20.46
  pour Bottom (rank 3): 66,22.3 64.15,22.3 64.14,22.25 64.14,20.48 64.17,20.44 65.94,20.44 66,20.46
  pour Bottom (rank 3): 64.14,22.3 62.29,22.3 62.28,22.25 62.28,20.48 62.31,20.44 64.08,20.44 64.14,20.46
  pour Bottom (rank 3): 60.42,22.3 58.57,22.3 58.56,22.25 58.56,20.48 58.59,20.44 60.36,20.44 60.42,20.46
  pour Bottom (rank 3): 58.56,22.3 56.71,22.3 56.7,22.25 56.7,20.48 56.73,20.44 58.5,20.44 58.56,20.46
  pour Bottom (rank 3): 54.84,22.3 52.99,22.3 52.98,22.25 52.98,20.48 53.01,20.44 54.78,20.44 54.84,20.46
  pour Bottom (rank 3): 51.12,22.3 49.27,22.3 49.26,22.25 49.26,20.48 49.29,20.44 51.06,20.44 51.12,20.46
  pour Bottom (rank 3): 49.26,22.3 47.41,22.3 47.4,22.25 47.4,20.48 47.43,20.44 49.2,20.44 49.26,20.46
  pour Bottom (rank 3): 47.4,22.3 45.56,22.3 45.54,22.25 45.54,20.48 45.57,20.44 47.34,20.44 47.4,20.46
  pour Bottom (rank 3): 45.54,22.3 43.7,22.3 43.68,22.25 43.68,20.48 43.71,20.44 45.48,20.44 45.54,20.46
  pour Bottom (rank 3): 43.68,22.3 41.84,22.3 41.82,22.25 41.82,20.48 41.85,20.44 43.62,20.44 43.68,20.46
  pour Bottom (rank 3): 41.82,22.3 39.98,22.3 39.96,22.25 39.96,20.48 39.99,20.44 41.76,20.44 41.82,20.46
  pour Bottom (rank 3): 80.87,20.44 79.03,20.44 79.01,20.39 79.01,18.62 79.05,18.58 80.82,18.58 80.87,18.6
  pour Bottom (rank 3): 79.01,20.44 77.17,20.44 77.15,20.39 77.15,18.62 77.19,18.58 78.96,18.58 79.01,18.6
  pour Bottom (rank 3): 73.43,20.44 71.59,20.44 71.58,20.39 71.58,18.62 71.61,18.58 73.38,18.58 73.43,18.6
  pour Bottom (rank 3): 71.58,20.44 69.73,20.44 69.72,20.39 69.72,18.62 69.75,18.58 71.52,18.58 71.58,18.6
  pour Bottom (rank 3): 69.72,20.44 67.87,20.44 67.86,20.39 67.86,18.62 67.89,18.58 69.66,18.58 69.72,18.6
  pour Bottom (rank 3): 67.86,20.44 66.01,20.44 66,20.39 66,18.62 66.03,18.58 67.8,18.58 67.86,18.6
  pour Bottom (rank 3): 66,20.44 64.15,20.44 64.14,20.39 64.14,18.62 64.17,18.58 65.94,18.58 66,18.6
  pour Bottom (rank 3): 58.56,20.44 56.71,20.44 56.7,20.39 56.7,18.62 56.73,18.58 58.5,18.58 58.56,18.6
  pour Bottom (rank 3): 52.98,20.44 51.13,20.44 51.12,20.39 51.12,18.62 51.15,18.58 52.92,18.58 52.98,18.6
  pour Bottom (rank 3): 51.12,20.44 49.27,20.44 49.26,20.39 49.26,18.62 49.29,18.58 51.06,18.58 51.12,18.6
  pour Bottom (rank 3): 49.26,20.44 47.41,20.44 47.4,20.39 47.4,18.62 47.43,18.58 49.2,18.58 49.26,18.6
  pour Bottom (rank 3): 47.4,20.44 45.55,20.44 45.54,20.39 45.54,18.62 45.57,18.58 47.34,18.58 47.4,18.6
  pour Bottom (rank 3): 45.54,20.44 43.7,20.44 43.68,20.39 43.68,18.62 43.71,18.58 45.48,18.58 45.54,18.6
  pour Bottom (rank 3): 43.68,20.44 41.84,20.44 41.82,20.39 41.82,18.62 41.85,18.58 43.62,18.58 43.68,18.6
  pour Bottom (rank 3): 38.1,20.44 36.26,20.44 36.24,20.39 36.24,18.62 36.27,18.58 38.04,18.58 38.1,18.6
  pour Bottom (rank 3): 66,18.58 64.15,18.58 64.14,18.53 64.14,16.76 64.17,16.72 65.94,16.72 66,16.74
  pour Bottom (rank 3): 64.14,18.58 62.29,18.58 62.28,18.53 62.28,16.76 62.31,16.72 64.08,16.72 64.14,16.74
  pour Bottom (rank 3): 60.42,18.58 58.57,18.58 58.56,18.53 58.56,16.76 58.59,16.72 60.36,16.72 60.42,16.74
  pour Bottom (rank 3): 54.84,18.58 52.99,18.58 52.98,18.53 52.98,16.76 53.01,16.72 54.78,16.72 54.84,16.74
  pour Bottom (rank 3): 52.98,18.58 51.13,18.58 51.12,18.53 51.12,16.76 51.15,16.72 52.92,16.72 52.98,16.74
  pour Bottom (rank 3): 51.12,18.58 49.27,18.58 49.26,18.53 49.26,16.76 49.29,16.72 51.06,16.72 51.12,16.74
  pour Bottom (rank 3): 43.68,18.58 41.84,18.58 41.82,18.53 41.82,16.76 41.85,16.72 43.62,16.72 43.68,16.74
  pour Bottom (rank 3): 36.24,18.58 34.4,18.58 34.38,18.53 34.38,16.76 34.41,16.72 36.18,16.72 36.24,16.74
  pour Bottom (rank 3): 80.87,16.72 79.03,16.72 79.01,16.67 79.01,14.9 79.05,14.86 80.82,14.86 80.87,14.88
  pour Bottom (rank 3): 79.01,16.72 77.17,16.72 77.15,16.67 77.15,14.9 77.19,14.86 78.96,14.86 79.01,14.88
  pour Bottom (rank 3): 77.15,16.72 75.31,16.72 75.29,16.67 75.29,14.9 75.33,14.86 77.1,14.86 77.15,14.88
  pour Bottom (rank 3): 75.29,16.72 73.45,16.72 73.43,16.67 73.43,14.9 73.47,14.86 75.24,14.86 75.29,14.88
  pour Bottom (rank 3): 73.43,16.72 71.59,16.72 71.58,16.67 71.58,14.9 71.61,14.86 73.38,14.86 73.43,14.88
  pour Bottom (rank 3): 71.58,16.72 69.73,16.72 69.72,16.67 69.72,14.9 69.75,14.86 71.52,14.86 71.58,14.88
  pour Bottom (rank 3): 69.72,16.72 67.87,16.72 67.86,16.67 67.86,14.9 67.89,14.86 69.66,14.86 69.72,14.88
  pour Bottom (rank 3): 62.28,16.72 60.43,16.72 60.42,16.67 60.42,14.9 60.45,14.86 62.22,14.86 62.28,14.88
  pour Bottom (rank 3): 60.42,16.72 58.57,16.72 58.56,16.67 58.56,14.9 58.59,14.86 60.36,14.86 60.42,14.88
  pour Bottom (rank 3): 58.56,16.72 56.71,16.72 56.7,16.67 56.7,14.9 56.73,14.86 58.5,14.86 58.56,14.88
  pour Bottom (rank 3): 56.7,16.72 54.85,16.72 54.84,16.67 54.84,14.9 54.87,14.86 56.64,14.86 56.7,14.88
  pour Bottom (rank 3): 51.12,16.72 49.27,16.72 49.26,16.67 49.26,14.9 49.29,14.86 51.06,14.86 51.12,14.88
  pour Bottom (rank 3): 47.4,16.72 45.55,16.72 45.54,16.67 45.54,14.9 45.57,14.86 47.34,14.86 47.4,14.88
  pour Bottom (rank 3): 43.68,16.72 41.84,16.72 41.82,16.67 41.82,14.9 41.85,14.86 43.62,14.86 43.68,14.88
  pour Bottom (rank 3): 36.24,16.72 34.4,16.72 34.38,16.67 34.38,14.9 34.41,14.86 36.18,14.86 36.24,14.88
  pour Bottom (rank 3): 80.87,14.86 79.03,14.86 79.01,14.81 79.01,13.04 79.05,13 80.82,13 80.87,13.02
  pour Bottom (rank 3): 69.72,14.86 67.87,14.86 67.86,14.81 67.86,13.04 67.89,13 69.66,13 69.72,13.02
  pour Bottom (rank 3): 66,14.86 64.15,14.86 64.14,14.81 64.14,13.04 64.17,13 65.94,13 66,13.02
  pour Bottom (rank 3): 64.14,14.86 62.29,14.86 62.28,14.81 62.28,13.04 62.31,13 64.08,13 64.14,13.02
  pour Bottom (rank 3): 60.42,14.86 58.57,14.86 58.56,14.81 58.56,13.04 58.59,13 60.36,13 60.42,13.02
  pour Bottom (rank 3): 52.98,14.86 51.13,14.86 51.12,14.81 51.12,13.04 51.15,13 52.92,13 52.98,13.02
  pour Bottom (rank 3): 51.12,14.86 49.27,14.86 49.26,14.81 49.26,13.04 49.29,13 51.06,13 51.12,13.02
  pour Bottom (rank 3): 43.68,14.86 41.84,14.86 41.82,14.81 41.82,13.04 41.85,13 43.62,13 43.68,13.02
  pour Bottom (rank 3): 38.1,14.86 36.26,14.86 36.24,14.81 36.24,13.04 36.27,13 38.04,13 38.1,13.02
  pour Bottom (rank 3): 80.87,13 79.03,13 79.01,12.95 79.01,11.18 79.05,11.14 80.82,11.14 80.87,11.16
  pour Bottom (rank 3): 77.15,13 75.31,13 75.29,12.95 75.29,11.18 75.33,11.14 77.1,11.14 77.15,11.16
  pour Bottom (rank 3): 75.29,13 73.45,13 73.43,12.95 73.43,11.18 73.47,11.14 75.24,11.14 75.29,11.16
  pour Bottom (rank 3): 73.43,13 71.59,13 71.58,12.95 71.58,11.18 71.61,11.14 73.38,11.14 73.43,11.16
  pour Bottom (rank 3): 69.72,13 67.87,13 67.86,12.95 67.86,11.18 67.89,11.14 69.66,11.14 69.72,11.16
  pour Bottom (rank 3): 64.14,13 62.29,13 62.28,12.95 62.28,11.18 62.31,11.14 64.08,11.14 64.14,11.16
  pour Bottom (rank 3): 60.42,13 58.57,13 58.56,12.95 58.56,11.18 58.59,11.14 60.36,11.14 60.42,11.16
  pour Bottom (rank 3): 58.56,13 56.71,13 56.7,12.95 56.7,11.18 56.73,11.14 58.5,11.14 58.56,11.16
  pour Bottom (rank 3): 52.98,13 51.13,13 51.12,12.95 51.12,11.18 51.15,11.14 52.92,11.14 52.98,11.16
  pour Bottom (rank 3): 51.12,13 49.27,13 49.26,12.95 49.26,11.18 49.29,11.14 51.06,11.14 51.12,11.16
  pour Bottom (rank 3): 49.26,13 47.41,13 47.4,12.95 47.4,11.18 47.43,11.14 49.2,11.14 49.26,11.16
  pour Bottom (rank 3): 47.4,13 45.55,13 45.54,12.95 45.54,11.18 45.57,11.14 47.34,11.14 47.4,11.16
  pour Bottom (rank 3): 45.54,13 43.7,13 43.68,12.95 43.68,11.18 43.71,11.14 45.48,11.14 45.54,11.16
  pour Bottom (rank 3): 43.68,13 41.84,13 41.82,12.95 41.82,11.18 41.85,11.14 43.62,11.14 43.68,11.16
  pour Bottom (rank 3): 80.87,11.14 79.03,11.14 79.01,11.09 79.01,9.32 79.05,9.29 80.82,9.29 80.87,9.3
  pour Bottom (rank 3): 77.15,11.14 75.31,11.14 75.29,11.09 75.29,9.32 75.33,9.29 77.1,9.29 77.15,9.3
  pour Bottom (rank 3): 75.29,11.14 73.45,11.14 73.43,11.09 73.43,9.32 73.47,9.29 75.24,9.29 75.29,9.3
  pour Bottom (rank 3): 73.43,11.14 71.59,11.14 71.58,11.09 71.58,9.32 71.61,9.29 73.38,9.29 73.43,9.3
  pour Bottom (rank 3): 69.72,11.14 67.87,11.14 67.86,11.09 67.86,9.32 67.89,9.29 69.66,9.29 69.72,9.3
  pour Bottom (rank 3): 64.14,11.14 62.29,11.14 62.28,11.09 62.28,9.32 62.31,9.29 64.08,9.29 64.14,9.3
  pour Bottom (rank 3): 62.28,11.14 60.43,11.14 60.42,11.09 60.42,9.32 60.45,9.29 62.22,9.29 62.28,9.3
  pour Bottom (rank 3): 60.42,11.14 58.57,11.14 58.56,11.09 58.56,9.32 58.59,9.29 60.36,9.29 60.42,9.3
  pour Bottom (rank 3): 58.56,11.14 56.71,11.14 56.7,11.09 56.7,9.32 56.73,9.29 58.5,9.29 58.56,9.3
  pour Bottom (rank 3): 56.7,11.14 54.85,11.14 54.84,11.09 54.84,9.32 54.87,9.29 56.64,9.29 56.7,9.3
  pour Bottom (rank 3): 51.12,11.14 49.27,11.14 49.26,11.09 49.26,9.32 49.29,9.29 51.06,9.29 51.12,9.3
  pour Bottom (rank 3): 49.2,11.14 47.41,11.14 47.4,11.09 47.4,9.32 47.43,9.29 49.2,9.29
  pour Bottom (rank 3): 43.68,11.14 41.84,11.14 41.82,11.09 41.82,9.32 41.85,9.29 43.62,9.29 43.68,9.3
  pour Bottom (rank 3): 39.96,11.14 38.12,11.14 38.1,11.09 38.1,9.32 38.13,9.29 39.9,9.29 39.96,9.3
  pour Bottom (rank 3): 38.1,11.14 36.26,11.14 36.24,11.09 36.24,9.32 36.27,9.29 38.04,9.29 38.1,9.3
  pour Bottom (rank 3): 80.87,9.29 79.03,9.29 79.01,9.23 79.01,7.46 79.05,7.43 80.82,7.43 80.87,7.44
  pour Bottom (rank 3): 77.15,9.29 75.31,9.29 75.29,9.23 75.29,7.46 75.33,7.43 77.1,7.43 77.15,7.44
  pour Bottom (rank 3): 75.29,9.29 73.45,9.29 73.43,9.23 73.43,7.46 73.47,7.43 75.24,7.43 75.29,7.44
  pour Bottom (rank 3): 73.43,9.29 71.59,9.29 71.58,9.23 71.58,7.46 71.61,7.43 73.38,7.43 73.43,7.44
  pour Bottom (rank 3): 69.72,9.29 67.87,9.29 67.86,9.23 67.86,7.46 67.89,7.43 69.66,7.43 69.72,7.44
  pour Bottom (rank 3): 66,9.29 64.15,9.29 64.14,9.23 64.14,7.46 64.17,7.43 65.94,7.43 66,7.44
  pour Bottom (rank 3): 60.42,9.29 58.57,9.29 58.56,9.23 58.56,7.46 58.59,7.43 60.36,7.43 60.42,7.44
  pour Bottom (rank 3): 56.7,9.29 54.85,9.29 54.84,9.23 54.84,7.46 54.87,7.43 56.64,7.43 56.7,7.44
  pour Bottom (rank 3): 54.84,9.29 52.99,9.29 52.98,9.23 52.98,7.46 53.01,7.43 54.78,7.43 54.84,7.44
  pour Bottom (rank 3): 49.26,9.29 47.41,9.29 47.4,9.23 47.4,7.46 47.43,7.43 49.2,7.43 49.26,7.44
  pour Bottom (rank 3): 45.54,9.29 43.7,9.29 43.68,9.23 43.68,7.46 43.71,7.43 45.48,7.43 45.54,7.44
  pour Bottom (rank 3): 43.68,9.29 41.84,9.29 41.82,9.23 41.82,7.46 41.85,7.43 43.62,7.43 43.68,7.44
  pour Bottom (rank 3): 41.82,9.29 39.98,9.29 39.96,9.23 39.96,7.46 39.99,7.43 41.76,7.43 41.82,7.44
  pour Bottom (rank 3): 38.1,9.29 36.26,9.29 36.24,9.23 36.24,7.46 36.27,7.43 38.04,7.43 38.1,7.44
  pour Bottom (rank 3): 36.24,9.29 34.4,9.29 34.38,9.23 34.38,7.46 34.41,7.43 36.18,7.43 36.24,7.44
  pour Bottom (rank 3): 80.87,7.42 79.03,7.42 79.01,7.37 79.01,5.6 79.05,5.57 80.82,5.57 80.87,5.58
  pour Bottom (rank 3): 69.72,7.42 67.87,7.42 67.86,7.37 67.86,5.6 67.89,5.57 69.66,5.57 69.72,5.58
  pour Bottom (rank 3): 66,7.42 64.15,7.42 64.14,7.37 64.14,5.6 64.17,5.57 65.94,5.57 66,5.58
  pour Bottom (rank 3): 62.28,7.42 60.43,7.42 60.42,7.37 60.42,5.6 60.45,5.57 62.22,5.57 62.28,5.58
  pour Bottom (rank 3): 58.56,7.42 56.71,7.42 56.7,7.37 56.7,5.6 56.73,5.57 58.5,5.57 58.56,5.58
  pour Bottom (rank 3): 51.12,7.42 49.27,7.42 49.26,7.37 49.26,5.6 49.29,5.57 51.06,5.57 51.12,5.58
  pour Bottom (rank 3): 49.26,7.42 47.41,7.42 47.4,7.37 47.4,5.6 47.43,5.57 49.2,5.57 49.26,5.58
  pour Bottom (rank 3): 47.4,7.42 45.55,7.42 45.54,7.37 45.54,5.6 45.57,5.57 47.34,5.57 47.4,5.58
  pour Bottom (rank 3): 45.54,7.42 43.7,7.42 43.68,7.37 43.68,5.6 43.71,5.57 45.48,5.57 45.54,5.58
  pour Bottom (rank 3): 43.68,7.42 41.84,7.42 41.82,7.37 41.82,5.6 41.85,5.57 43.62,5.57 43.68,5.58
  pour Bottom (rank 3): 80.87,5.57 79.03,5.57 79.01,5.51 79.01,3.74 79.05,3.71 80.82,3.71 80.87,3.72
  pour Bottom (rank 3): 79.01,5.57 77.17,5.57 77.15,5.51 77.15,3.74 77.19,3.71 78.96,3.71 79.01,3.72
  pour Bottom (rank 3): 77.15,5.57 75.31,5.57 75.29,5.51 75.29,3.74 75.33,3.71 77.1,3.71 77.15,3.72
  pour Bottom (rank 3): 75.29,5.57 73.45,5.57 73.43,5.51 73.43,3.74 73.47,3.71 75.24,3.71 75.29,3.72
  pour Bottom (rank 3): 73.43,5.57 71.59,5.57 71.58,5.51 71.58,3.74 71.61,3.71 73.38,3.71 73.43,3.72
  pour Bottom (rank 3): 71.58,5.57 69.73,5.57 69.72,5.51 69.72,3.74 69.75,3.71 71.52,3.71 71.58,3.72
  pour Bottom (rank 3): 69.72,5.57 67.87,5.57 67.86,5.51 67.86,3.74 67.89,3.71 69.66,3.71 69.72,3.72
  pour Bottom (rank 3): 66,5.57 64.15,5.57 64.14,5.51 64.14,3.74 64.17,3.71 65.94,3.71 66,3.72
  pour Bottom (rank 3): 60.42,5.57 58.57,5.57 58.56,5.51 58.56,3.74 58.59,3.71 60.36,3.71 60.42,3.72
  pour Bottom (rank 3): 51.12,5.57 49.27,5.57 49.26,5.51 49.26,3.74 49.29,3.71 51.06,3.71 51.12,3.72
  pour Bottom (rank 3): 41.82,5.57 39.98,5.57 39.96,5.51 39.96,3.74 39.99,3.71 41.76,3.71 41.82,3.72
  pour Bottom (rank 3): 36.24,5.57 34.4,5.57 34.38,5.51 34.38,3.74 34.41,3.71 36.18,3.71 36.24,3.72
  pour Top (rank 3): 7.4,40.66 7.44,40.61 7.5,40.55 7.55,40.5 7.6,40.44 7.66,40.39 7.72,40.35 7.78,40.3 7.84,40.25 7.9,40.21 7.96,40.17 8.03,40.14 8.1,40.1 8.16,40.07 8.23,40.04 8.3,40.01 8.44,39.95 8.59,39.91 8.73,39.87 8.88,39.84 9.03,39.82 9.18,39.81 9.33,39.8 9.48,39.8 9.63,39.8 9.78,39.81 9.93,39.83 10.08,39.86 10.23,39.89 10.37,39.93 10.44,39.95 10.52,39.98 10.58,40.01 10.65,40.04 10.72,40.07 10.79,40.11 10.85,40.15 10.91,40.19 10.97,40.24 11.03,40.28 11.09,40.33 11.14,40.39 11.19,40.44 11.24,40.5 11.29,40.56 11.33,40.62 11.37,40.69 11.41,40.75 11.44,40.82 11.48,40.89 11.51,40.95 11.53,41.02 11.56,41.1 11.58,41.17 11.6,41.24 11.64,41.39 11.66,41.54 11.68,41.69 11.69,41.84 11.7,41.91 11.7,42.06 11.7,47.56 11.7,47.64 8.05,44.96 8.03,44.9 8.03,43.02 10.03,44.49 10.06,44.46 10.06,41.97 10.05,41.9 10.05,41.82 10.04,41.75 10.02,41.67 10.01,41.6 9.98,41.53 9.95,41.46 9.91,41.4 9.86,41.34 9.81,41.29 9.75,41.24 9.68,41.2 9.62,41.17 9.54,41.15 9.47,41.14 9.39,41.13 9.32,41.13 9.24,41.13 9.17,41.14 9.1,41.15 9.02,41.17 8.95,41.2 8.88,41.23 8.82,41.26 8.75,41.3 8.69,41.34 8.63,41.39 8.57,41.44 8.52,41.49 8.47,41.54 8.42,41.6 8.32,41.72 8.27,41.7
  pour Bottom (rank 3): 11.79,40.76 10.97,41.74 10.92,41.75 10.83,41.64 10.79,41.59 10.74,41.54 10.69,41.49 10.63,41.45 10.58,41.4 10.52,41.36 10.46,41.32 10.4,41.29 10.33,41.26 10.26,41.24 10.2,41.22 10.13,41.21 10.06,41.2 9.99,41.2 9.92,41.2 9.85,41.21 9.78,41.22 9.71,41.24 9.64,41.27 9.58,41.3 9.53,41.35 9.48,41.4 9.43,41.45 9.4,41.51 9.37,41.58 9.34,41.64 9.33,41.71 9.31,41.78 9.3,41.85 9.3,41.92 9.3,41.99 9.3,44.32 9.32,44.35 11.2,42.97 11.2,44.74 11.18,44.79 7.76,47.3 7.76,47.23 7.76,42.07 7.76,41.93 7.76,41.86 7.77,41.72 7.79,41.58 7.82,41.44 7.85,41.3 7.87,41.24 7.89,41.17 7.91,41.1 7.94,41.04 7.96,40.97 8,40.91 8.03,40.85 8.06,40.78 8.1,40.73 8.14,40.67 8.19,40.61 8.23,40.56 8.28,40.51 8.33,40.46 8.38,40.41 8.44,40.36 8.49,40.32 8.55,40.28 8.61,40.25 8.67,40.21 8.74,40.18 8.8,40.15 8.87,40.12 8.93,40.1 9,40.08 9.14,40.04 9.27,40.01 9.41,39.98 9.55,39.97 9.69,39.96 9.84,39.95 9.98,39.96 10.12,39.96 10.26,39.98 10.4,40 10.54,40.02 10.67,40.06 10.81,40.1 10.94,40.15 11.07,40.2 11.13,40.24 11.2,40.27 11.32,40.34 11.38,40.38 11.43,40.42 11.49,40.47 11.54,40.51 11.6,40.56 11.65,40.61 11.7,40.66 11.74,40.71
  pour Top (rank 3): 33.64,45.38 32.8,44.53 32.75,44.48 33.6,43.62 33.65,43.59 33.91,43.84 33.95,43.89 33.4,44.44 33.36,44.49 33.91,45.04 33.95,45.09
  pour Top (isolate 0.61, rank 3): 29.46,22.1 30.1,21.46 34.42,21.46 35.05,22.1 35.05,24 35.69,24.64 48.13,24.64 52.45,28.96 53.34,28.96 54.74,27.56 56.52,27.56 57.02,28.07 57.02,44.58 55.5,46.1 51.18,46.1 50.29,46.99 48.13,46.99 47.12,45.97 47.12,30.35 45.85,29.08 33.78,29.08 29.46,24.77
N$1  (via drill 0.3)
  Top 0.152: v55.88,28.83 55.88,43.94 54.86,44.96 50.42,44.96 50.38,44.92 NT3H1101.LA
  Bottom 0.152: v55.88,28.83 55.93,28.88 59.94,28.88 60.57,28.24 ANT.P$2
N$2
  Top 0.152: ANT.P$1 55.53,26.34 55.15,26.72 55.15,43.56 54.42,44.29 NT3H1101.LB
N$3
  Top 0.152: NT3H1101.VOUT C1.1 50.33,34.82 R1.1
  Top 0.25: NT3H1101.VOUT NT3H1101.VCC
N$4
  Top 0.152: R1.2 50.34,28.91 47.42,25.99 35.11,25.99 33.26,24.14 LED1.A
N$5  (via drill 0.35)
  Top 0.152: v5.21,20.7 36.96,20.7 | 36.96,20.7 42.16,20.7 v42.8,21.34 | 36.96,20.7 38.61,22.35 44.96,22.35 45.72,23.11 v46.48,23.11
N$6
  Top 0.152: LED1.C 31.28,23.12 31.28,24.52 34.45,27.69 46.61,27.69 48.58,29.66 48.58,38.16 C1.2 48.63,45.21 49.02,45.59 49.52,45.59 49.84,45.27 NT3H1101.VSS

### Text on the board
tPlace: SNAP
bPlace: SNAP
tStop: phone stand | Jason Tse | hardware design engineer